# Altium schematic sheet Main.SchDoc
size 594 x 420 mm; Organization: Altium Limited; Address1: L3, 12a Rodborough Rd; Address2: Frenchs Forest; Address3: NSW; Address4: Australia 2086
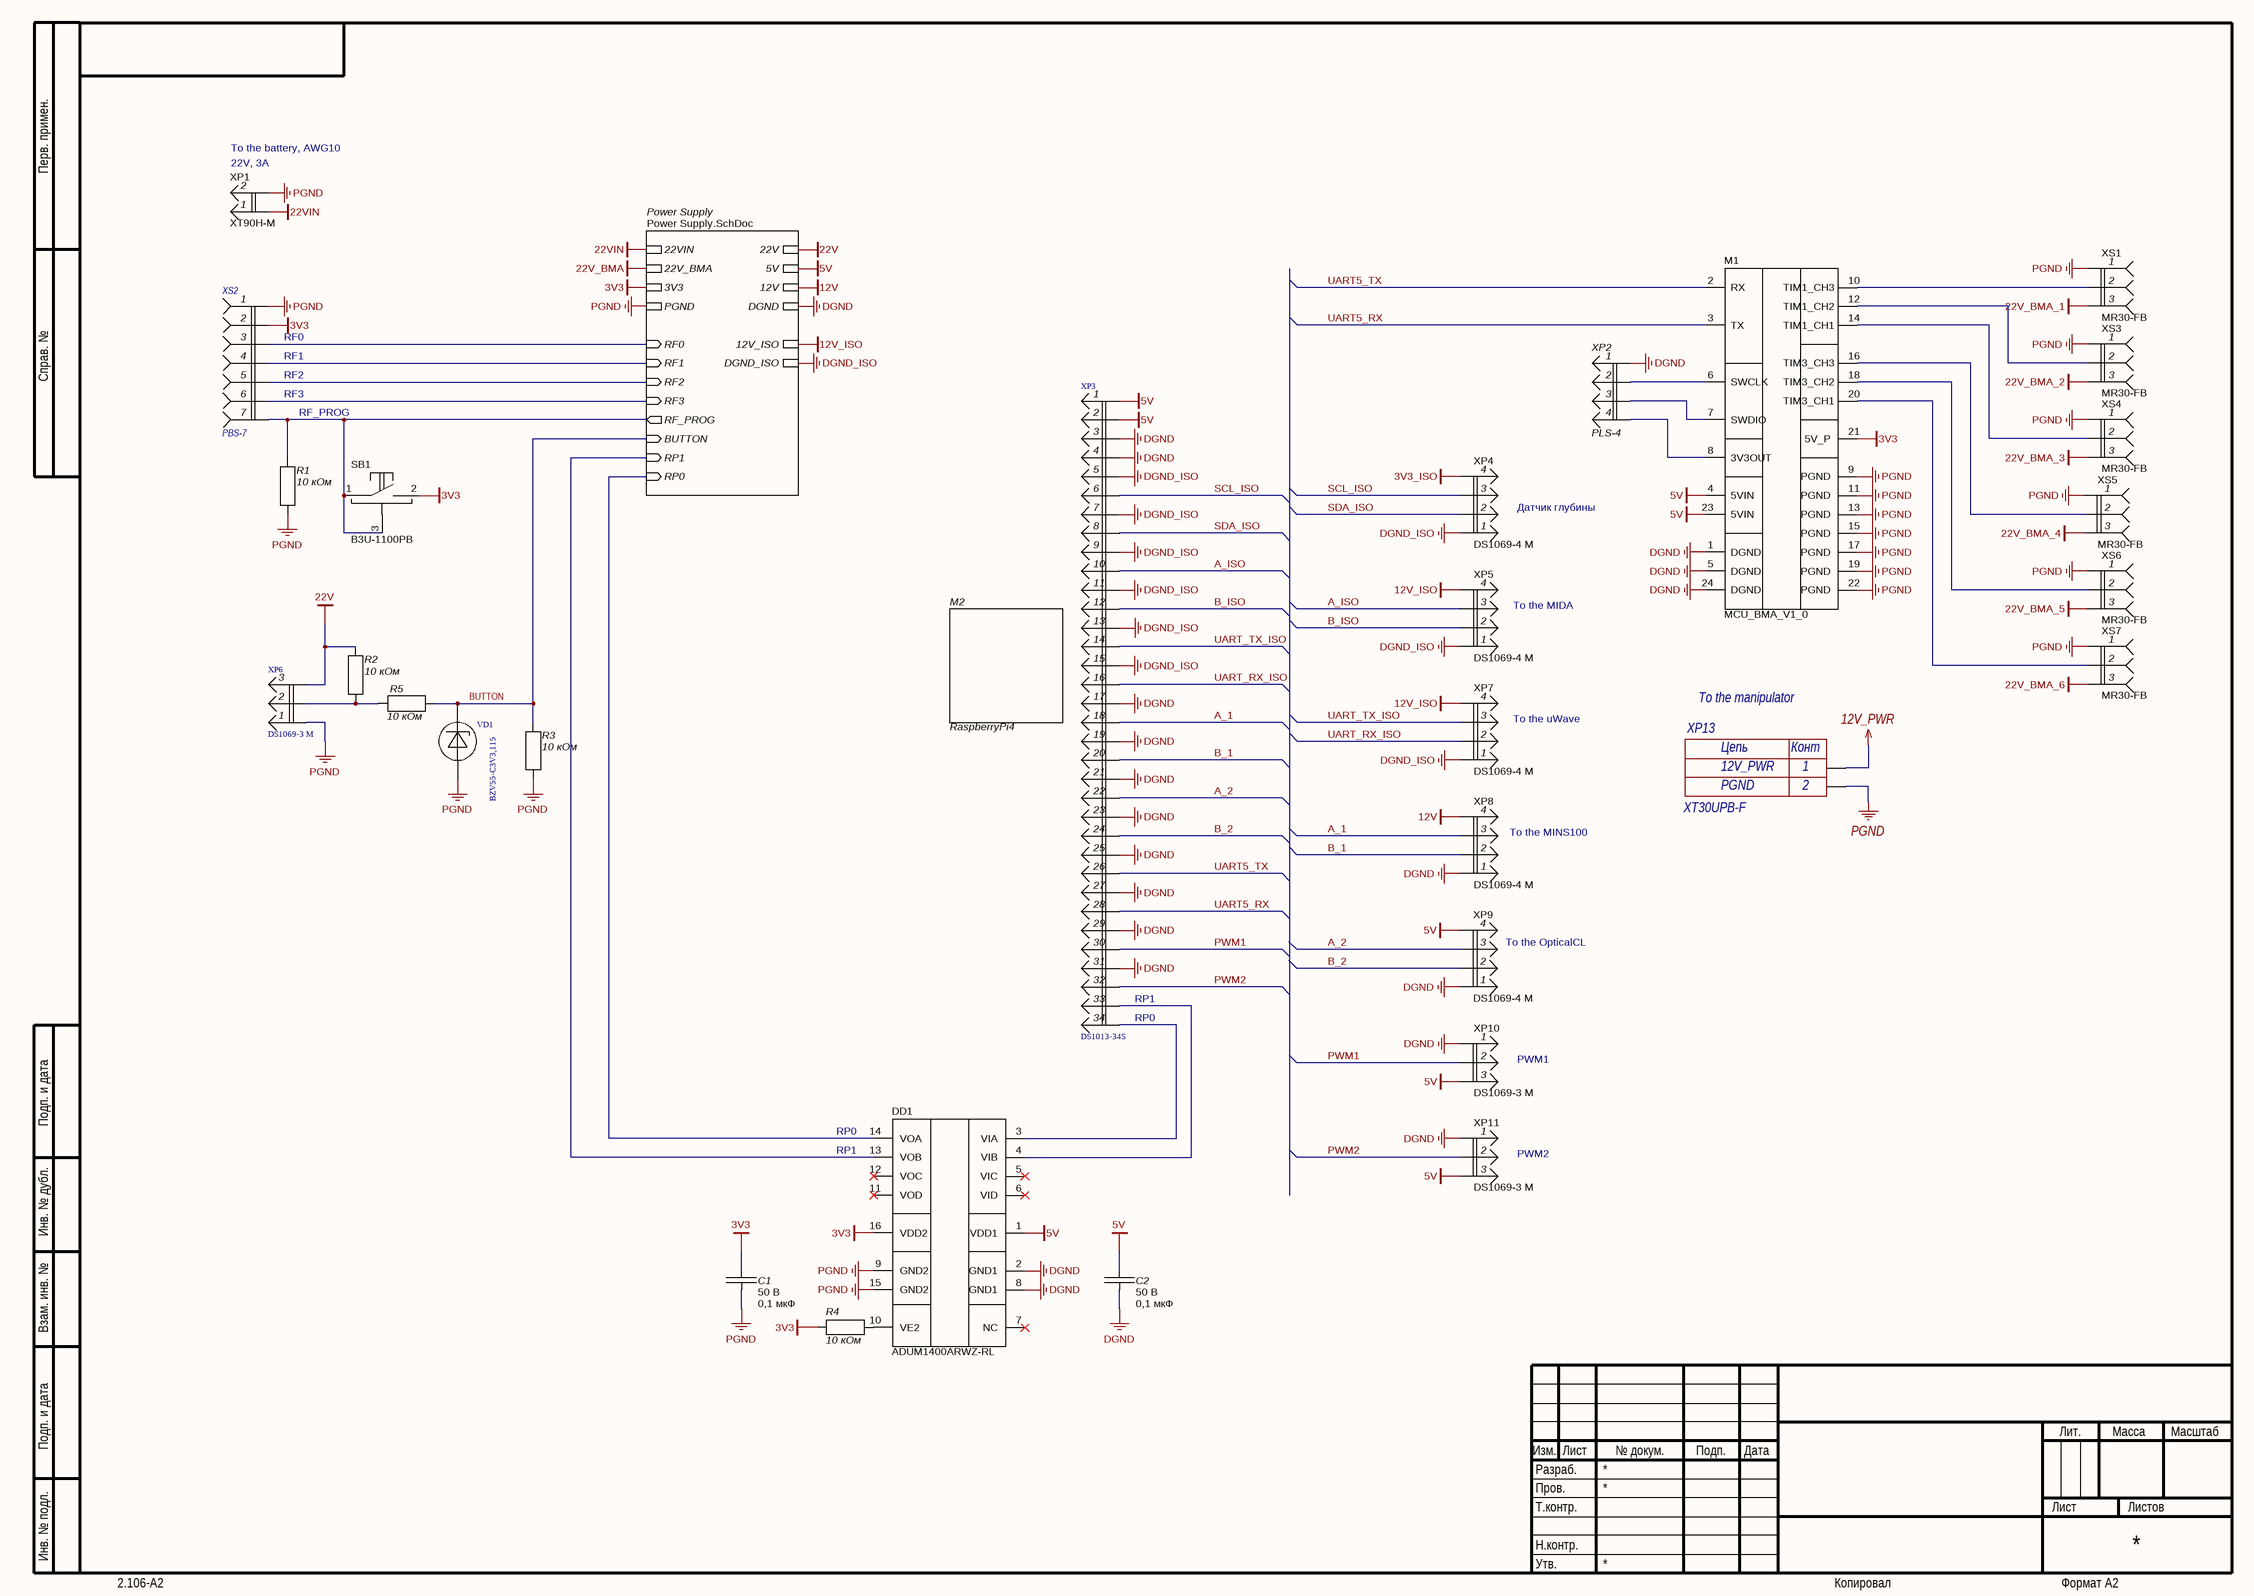
[diagram p0: Main.SchDoc]

## Parts
C1  Voltage: 50 В  [C0603C]  (hidden comment: 0,1 мкФ)
C2  Voltage: 50 В  [C0603C]  (hidden comment: 0,1 мкФ)
DD1  ADUM1400ARWZ-RL  [SOIC-Wide-16]
M1  MCU_BMA_V1_0  [MCU_BMA_V1_0]
M2  RaspberryPi4  [Raspberry+PI4MB_HAT_V2]
R1  10 кОм  [C0603R]
R2  10 кОм  [C0603R]
R3  10 кОм  [C0603R]
R4  10 кОм  [C0603R]
R5  10 кОм  [C0603R]
SB1  B3U-1100PB  [B3U-1100P]
VD1  BZV55-C3V3,115  [SOD80C]
XP1  XT90H-M  [XT90H-M]
XP2  PLS-4  [PLS-4]
XP3  DS1013-34S  [IDC-34MS]
XP4  DS1069-4 M  [DS1069-4 M]
XP5  DS1069-4 M  [DS1069-4 M]
XP6  DS1069-3 M  [DS1069-3 M]
XP7  DS1069-4 M  [DS1069-4 M]
XP8  DS1069-4 M  [DS1069-4 M]
XP9  DS1069-4 M  [DS1069-4 M]
XP10  DS1069-3 M  [DS1069-3 M]
XP11  DS1069-3 M  [DS1069-3 M]
XP13  XT30UPB-F  Value2: PGND  Value1: 12V_PWR  [XT30UPB-F]
XS1  MR30-FB  [MR30-FB]
XS2  PBS-7  [PBS-7]
XS3  MR30-FB  [MR30-FB]
XS4  MR30-FB  [MR30-FB]
XS5  MR30-FB  [MR30-FB]
XS6  MR30-FB  [MR30-FB]
XS7  MR30-FB  [MR30-FB]

## Sub-sheets
Power Supply = Power Supply.SchDoc: 22VIN, 22V, PGND, DGND, DGND_ISO, 12V, 5V, 12V_ISO, RF1 (in), RF2 (in), RF3 (in), BUTTON (in), RP1 (in), RP0 (in), 3V3, RF0 (in), 22V_BMA, RF_PROG (out)

## Nets
3V3: C1.1 DD1.16(VDD2) M1.21(5V_P) R4.2 SB1.2 XS2.2 ; sheet Power Supply/3V3
3V3_ISO: XP4.4
5V: C2.1 DD1.1(VDD1) M1.4(5VIN) M1.23(5VIN) XP3.1 XP3.2 XP9.4 XP10.3 XP11.3 ; sheet Power Supply/5V
12V: XP8.4 ; sheet Power Supply/12V
12V_ISO: XP5.4 XP7.4 ; sheet Power Supply/12V_ISO
12V_PWR: XP13.P
22V: R2.1 XP6.3 ; sheet Power Supply/22V
22V_BMA: sheet Power Supply/22V_BMA
22V_BMA_1: XS1.3
22V_BMA_2: XS3.3
22V_BMA_3: XS4.3
22V_BMA_4: XS5.3
22V_BMA_5: XS6.3
22V_BMA_6: XS7.3
22VIN: XP1.1 ; sheet Power Supply/22VIN
DGND: C2.2 DD1.2(GND1) DD1.8(GND1) M1.1(DGND) M1.5(DGND) M1.24(DGND) XP2.1 XP3.3 XP3.4 XP3.17 XP3.19 XP3.21 XP3.23 XP3.25 XP3.27 XP3.29 XP3.31 XP8.1 XP9.1 XP10.1 XP11.1 ; sheet Power Supply/DGND
DGND_ISO: XP3.5 XP3.7 XP3.9 XP3.11 XP3.13 XP3.15 XP4.1 XP5.1 XP7.1 ; sheet Power Supply/DGND_ISO
PGND: C1.2 DD1.9(GND2) DD1.15(GND2) M1.9(PGND) M1.11(PGND) M1.13(PGND) M1.15(PGND) M1.17(PGND) M1.19(PGND) M1.22(PGND) R1.2 R3.2 VD1.2(ANODE) XP1.2 XP6.1 XP13.N XS1.1 XS2.1 XS3.1 XS4.1 XS5.1 XS6.1 XS7.1 ; sheet Power Supply/PGND
A_1: XP3.18 XP8.3
A_2: XP3.22 XP9.3
A_ISO: XP3.10 XP5.3
B_1: XP3.20 XP8.2
B_2: XP3.24 XP9.2
B_ISO: XP3.12 XP5.2
BUTTON: R3.1 R5.2 VD1.1(CATHODE) ; sheet Power Supply/BUTTON
PWM1: XP3.30 XP10.2
PWM2: XP3.32 XP11.2
SCL_ISO: XP3.6 XP4.3
SDA_ISO: XP3.8 XP4.2
UART5_RX: M1.3(TX) XP3.28
UART5_TX: M1.2(RX) XP3.26
UART_RX_ISO: XP3.16 XP7.2
UART_TX_ISO: XP3.14 XP7.3
NetDD1_3: DD1.3(VIA) XP3.34
NetDD1_4: DD1.4(VIB) XP3.33
NetDD1_10: DD1.10(VE2) R4.1
NetDD1_13: DD1.13(VOB) ; sheet Power Supply/RP1
NetDD1_14: DD1.14(VOA) ; sheet Power Supply/RP0
NetM1_6: M1.6(SWCLK) XP2.2
NetM1_7: M1.7(SWDIO) XP2.3
NetM1_8: M1.8(3V3OUT) XP2.4
NetM1_10: M1.10(TIM1_CH3) XS1.2
NetM1_12: M1.12(TIM1_CH2) XS3.2
NetM1_14: M1.14(TIM1_CH1) XS4.2
NetM1_16: M1.16(TIM3_CH3) XS5.2
NetM1_18: M1.18(TIM3_CH2) XS6.2
NetM1_20: M1.20(TIM3_CH1) XS7.2
NetR1_1: R1.1 SB1.1 SB1.3 XS2.7 ; sheet Power Supply/RF_PROG
NetR2_2: R2.2 R5.1 XP6.2
NetXS2_3: XS2.3 ; sheet Power Supply/RF0
NetXS2_4: XS2.4 ; sheet Power Supply/RF1
NetXS2_5: XS2.5 ; sheet Power Supply/RF2
NetXS2_6: XS2.6 ; sheet Power Supply/RF3

Not connected (* = marked no-connect by the designer): DD1 5(VIC)* 6(VID)* 7(NC)* 11(VOD)* 12(VOC)*

## Notes on the sheet
- (near XP1) To the battery, AWG10
- (near XP1) 22V, 3A
- RF0
- RF1
- RF2
- RF3
- RF_PROG
- (near XP4) Датчик глубины
- (near XP5) To the MIDA
- (near XP7) To the uWave
- To the manipulator
- (near XP8) To the MINS100
- (near XP9) To the OpticalCL
- RP1
- RP0
- (near XP10) PWM1
- (near XP11) PWM2
- Перв. примен.
- Справ. №
- Подп. и дата
- Инв. № дубл.
- Взам. инв. №
- Разраб.
- Изм.
- Лист
- № докум.
- Подп.
- Дата
- Лит.
- Масса
- Масштаб
- Пров.
- Т.контр.
- Листов
- Инв. № подл.
- Утв.
- Н.контр.
- 2.106-A2
- Копировал
- Формат А2
- (in symbol XT30UPB-F) Цепь; Конт; 1; 2

## Library data of the parts
C1 C2 = CC0603KRX7R9BB104: SMD 0603 ; X7R; 0,1 мкФ; 50 В; Manufacturer: YAGEO; Persent: ±5%; Type: Ceramic; Part Number: CC0603KRX7R9BB104; Package: SMD 0603; Dielectric: X7R; ComponentLink1Description: Datasheet; Value: 0,1 мкФ
DD1 = ADUM1400ARWZ-RL: ISO; Manufacturer: Analog Devices; Part Number: ADUM1400ARWZ-RL; Type: ISO
M1 = MCU_BMA_V1_0: MCU_BMA_V1_0, user module; Type: User
M2 = Raspberry+PI4MB_HAT_V2: Part Number: RaspberryPi4; Type: User; ComponentLink1Description: Datasheet; Manufacturer: Raspberry
R1-R5 = RC0603FR-0710KL: SMD 0603; 0,1; 1%; 10 кОм; Manufacturer: Yageo; Power: 0,1; Part Number: RC0603FR-0710KL; Package: SMD 0603; Persent: 1%; Value: 10 кОм; Category: R
SB1 = B3U-1100PB: SB; Manufacturer: OMRON; Part Number: B3U-1100PB; Type: SB
VD1 = BZV55-C3V3,115: Zener, 3,3В; Manufacturer: Nexperia; Part Number: BZV55-C3V3,115; Type: Zener
XP1 = XT90H-M: Manufacturer: AMASS; Part Number: XT90H-M; Type: XT
XP3 = DS1013-34S: IDC; Manufacturer: Connfly; Part Number: DS1013-34S; Type: IDC
XP4 XP5 XP7-XP9 = DS1069-4 M: Manufacturer: Connfly; Part Number: DS1069-4 M; Type: XH
XP6 XP10 XP11 = DS1069-3 M: Manufacturer: Connfly; Part Number: DS1069-3 M; Type: XH
XP13 = XT30UPB-F: 30 А (15 продолжительно), прямая мать; Part Number: XT30UPB-F
XS1 XS3-XS7 = MR30-FB: Manufacturer: AMASS; Part Number: MR30-FB; Type: XT
XP2 = PLS-4: Part Number: PLS-4; Type: PLS; ComponentLink1Description: Datasheet; Manufacturer: -
XS2 = PBS-7: Part Number: PBS-7; Type: PBS; ComponentLink1Description: Datasheet; Manufacturer: -